# Altium schematic sheet Ｄｒｉｖｅｒｓ.SchDoc
size Letter; SheetNumber: 4; SheetTotal: 5
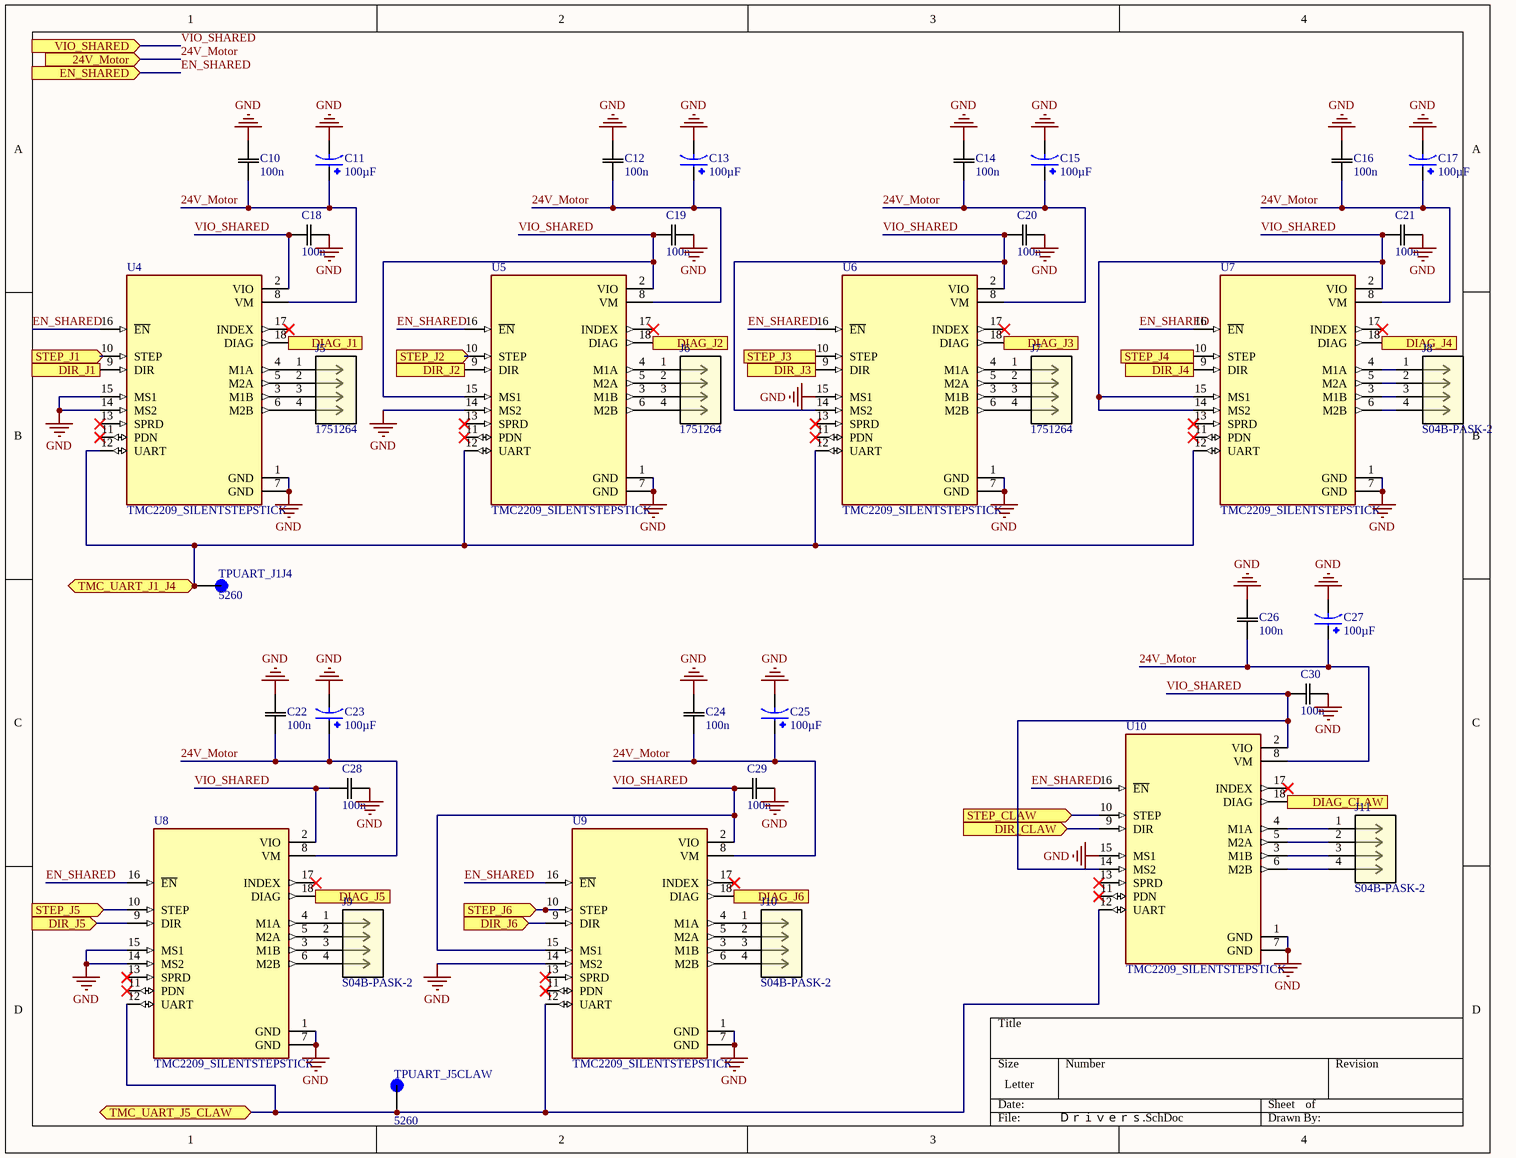
[diagram p0: Ｄｒｉｖｅｒｓ.SchDoc]

## Parts
C10  Capacitance: 100n  [CAP_CL_21_SAM]  (hidden comment: CL21B104KCCWPNC)
C11  value 100µF  [CAPPRD500W60D800H1150]  (hidden comment: EEUFR1H101B)
C12  Capacitance: 100n  [CAP_CL_21_SAM]  (hidden comment: CL21B104KCCWPNC)
C13  value 100µF  [CAPPRD500W60D800H1150]  (hidden comment: EEUFR1H101B)
C14  Capacitance: 100n  [CAP_CL_21_SAM]  (hidden comment: CL21B104KCCWPNC)
C15  value 100µF  [CAPPRD500W60D800H1150]  (hidden comment: EEUFR1H101B)
C16  Capacitance: 100n  [CAP_CL_21_SAM]  (hidden comment: CL21B104KCCWPNC)
C17  value 100µF  [CAPPRD500W60D800H1150]  (hidden comment: EEUFR1H101B)
C18  Capacitance: 100n  [CAP_CL_21_SAM]  (hidden comment: CL21B104KCCWPNC)
C19  Capacitance: 100n  [CAP_CL_21_SAM]  (hidden comment: CL21B104KCCWPNC)
C20  Capacitance: 100n  [CAP_CL_21_SAM]  (hidden comment: CL21B104KCCWPNC)
C21  Capacitance: 100n  [CAP_CL_21_SAM]  (hidden comment: CL21B104KCCWPNC)
C22  Capacitance: 100n  [CAP_CL_21_SAM]  (hidden comment: CL21B104KCCWPNC)
C23  value 100µF  [CAPPRD500W60D800H1150]  (hidden comment: EEUFR1H101B)
C24  Capacitance: 100n  [CAP_CL_21_SAM]  (hidden comment: CL21B104KCCWPNC)
C25  value 100µF  [CAPPRD500W60D800H1150]  (hidden comment: EEUFR1H101B)
C26  Capacitance: 100n  [CAP_CL_21_SAM]  (hidden comment: CL21B104KCCWPNC)
C27  value 100µF  [CAPPRD500W60D800H1150]  (hidden comment: EEUFR1H101B)
C28  Capacitance: 100n  [CAP_CL_21_SAM]  (hidden comment: CL21B104KCCWPNC)
C29  Capacitance: 100n  [CAP_CL_21_SAM]  (hidden comment: CL21B104KCCWPNC)
C30  Capacitance: 100n  [CAP_CL_21_SAM]  (hidden comment: CL21B104KCCWPNC)
J5  1751264  [CONN_1751264_PXC]
J6  1751264  [CONN_1751264_PXC]
J7  1751264  [CONN_1751264_PXC]
J8  S04B-PASK-2  [CONN4_S04B-PASK_JST]
J9  S04B-PASK-2  [CONN4_S04B-PASK_JST]
J10  S04B-PASK-2  [CONN4_S04B-PASK_JST]
J11  S04B-PASK-2  [CONN4_S04B-PASK_JST]
TPUART_J1J4  5260  [KEYSTONE_5260]
TPUART_J5CLAW  5260  [KEYSTONE_5260]
U4  TMC2209_SILENTSTEPSTICK  [MODULE_TMC2209_SILENTSTEPSTICK]
U5  TMC2209_SILENTSTEPSTICK  [MODULE_TMC2209_SILENTSTEPSTICK]
U6  TMC2209_SILENTSTEPSTICK  [MODULE_TMC2209_SILENTSTEPSTICK]
U7  TMC2209_SILENTSTEPSTICK  [MODULE_TMC2209_SILENTSTEPSTICK]
U8  TMC2209_SILENTSTEPSTICK  [MODULE_TMC2209_SILENTSTEPSTICK]
U9  TMC2209_SILENTSTEPSTICK  [MODULE_TMC2209_SILENTSTEPSTICK]
U10  TMC2209_SILENTSTEPSTICK  [MODULE_TMC2209_SILENTSTEPSTICK]

## Ports
24V_Motor (in, see Overall_Schematic[4D], Entry_Protection[4C]), DIAG_CLAW (out, see Overall_Schematic[4C], MC[3B]), DIAG_J1 (out, see Overall_Schematic[4B], MC[3A]), DIAG_J2 (out, see Overall_Schematic[4C], MC[3B]), DIAG_J3 (out, see Overall_Schematic[4C], MC[3B]), DIAG_J4 (out, see Overall_Schematic[4C], MC[3B]), DIAG_J5 (out, see Overall_Schematic[4C], MC[3B]), DIAG_J6 (out, see Overall_Schematic[4C], MC[3B]), DIR_CLAW (in, see Overall_Schematic[4B], MC[4B]), DIR_J1 (in, see Overall_Schematic[4B], MC[4B]), DIR_J2 (in, see Overall_Schematic[4B], MC[4B]), DIR_J3 (in, see Overall_Schematic[4B], MC[4B]), DIR_J4 (in, see Overall_Schematic[4B], MC[4B]), DIR_J5 (in, see Overall_Schematic[4B], MC[4B]), DIR_J6 (in, see Overall_Schematic[4B], MC[4B]), EN_SHARED (in, see Overall_Schematic[4C], MC[2B]), STEP_CLAW (in, see Overall_Schematic[4B], MC[2B]), STEP_J1 (in, see Overall_Schematic[4A], MC[2C]), STEP_J2 (in, see Overall_Schematic[4A], MC[4B]), STEP_J3 (in, see Overall_Schematic[4A], MC[4B]), STEP_J4 (in, see Overall_Schematic[4A], MC[4C]), STEP_J5 (in, see Overall_Schematic[4A], MC[2C]), STEP_J6 (in, see Overall_Schematic[4A], MC[2C]), TMC_UART_J1_J4 (bidir, see Overall_Schematic[4A], MC[4C]), TMC_UART_J5_CLAW (bidir, see Overall_Schematic[4A], MC[4C]), VIO_SHARED (in, see Overall_Schematic[4C], MC[3C], Spare_Pins[1A])

## Nets
GND: C10.2 C11.N C12.2 C13.N C14.2 C15.N C16.2 C17.N C18.2 C19.2 C20.2 C21.2 C22.2 C23.N C24.2 C25.N C26.2 C27.N C28.2 C29.2 C30.2 U4.1(GND) U4.7(GND) U4.14(MS2) U4.15(MS1) U5.1(GND) U5.7(GND) U5.14(MS2) U6.1(GND) U6.7(GND) U6.15(MS1) U7.1(GND) U7.7(GND) U8.1(GND) U8.7(GND) U8.14(MS2) U8.15(MS1) U9.1(GND) U9.7(GND) U9.14(MS2) U10.1(GND) U10.7(GND) U10.15(MS1)
24V_Motor: C10.1 C11.P C12.1 C13.P C14.1 C15.P C16.1 C17.P C22.1 C23.P C24.1 C25.P C26.1 C27.P U4.8(VM) U5.8(VM) U6.8(VM) U7.8(VM) U8.8(VM) U9.8(VM) U10.8(VM) ; port 24V_Motor
DIAG_CLAW: U10.18(DIAG) ; port DIAG_CLAW
DIAG_J1: U4.18(DIAG) ; port DIAG_J1
DIAG_J2: U5.18(DIAG) ; port DIAG_J2
DIAG_J3: U6.18(DIAG) ; port DIAG_J3
DIAG_J4: U7.18(DIAG) ; port DIAG_J4
DIAG_J5: U8.18(DIAG) ; port DIAG_J5
DIAG_J6: U9.18(DIAG) ; port DIAG_J6
DIR_CLAW: U10.9(DIR) ; port DIR_CLAW
DIR_J1: U4.9(DIR) ; port DIR_J1
DIR_J2: U5.9(DIR) ; port DIR_J2
DIR_J3: U6.9(DIR) ; port DIR_J3
DIR_J4: U7.9(DIR) ; port DIR_J4
DIR_J5: U8.9(DIR) ; port DIR_J5
DIR_J6: U9.9(DIR) ; port DIR_J6
EN_SHARED: U4.16(~{EN}) U5.16(~{EN}) U6.16(~{EN}) U7.16(~{EN}) U8.16(~{EN}) U9.16(~{EN}) U10.16(~{EN}) ; port EN_SHARED
STEP_CLAW: U10.10(STEP) ; port STEP_CLAW
STEP_J1: U4.10(STEP) ; port STEP_J1
STEP_J2: U5.10(STEP) ; port STEP_J2
STEP_J3: U6.10(STEP) ; port STEP_J3
STEP_J4: U7.10(STEP) ; port STEP_J4
STEP_J5: U8.10(STEP) ; port STEP_J5
STEP_J6: U9.10(STEP) ; port STEP_J6
TMC_UART_J1_J4: TPUART_J1J4.1(TP) U4.12(UART) U5.12(UART) U6.12(UART) U7.12(UART) ; port TMC_UART_J1_J4
TMC_UART_J5_CLAW: TPUART_J5CLAW.1(TP) U8.12(UART) U9.12(UART) U10.12(UART) ; port TMC_UART_J5_CLAW
VIO_SHARED: C18.1 C19.1 C20.1 C21.1 C28.1 C29.1 C30.1 U4.2(VIO) U5.2(VIO) U5.15(MS1) U6.2(VIO) U6.14(MS2) U7.2(VIO) U7.14(MS2) U7.15(MS1) U8.2(VIO) U9.2(VIO) U9.15(MS1) U10.2(VIO) U10.14(MS2) ; port VIO_SHARED
NetJ5_1: J5.1 U4.4(M1A)
NetJ5_2: J5.2 U4.5(M2A)
NetJ5_3: J5.3 U4.3(M1B)
NetJ5_4: J5.4 U4.6(M2B)
NetJ6_1: J6.1 U5.4(M1A)
NetJ6_2: J6.2 U5.5(M2A)
NetJ6_3: J6.3 U5.3(M1B)
NetJ6_4: J6.4 U5.6(M2B)
NetJ7_1: J7.1 U6.4(M1A)
NetJ7_2: J7.2 U6.5(M2A)
NetJ7_3: J7.3 U6.3(M1B)
NetJ7_4: J7.4 U6.6(M2B)
NetJ8_1: J8.1 U7.4(M1A)
NetJ8_2: J8.2 U7.5(M2A)
NetJ8_3: J8.3 U7.3(M1B)
NetJ8_4: J8.4 U7.6(M2B)
NetJ9_1: J9.1 U8.4(M1A)
NetJ9_2: J9.2 U8.5(M2A)
NetJ9_3: J9.3 U8.3(M1B)
NetJ9_4: J9.4 U8.6(M2B)
NetJ10_1: J10.1 U9.4(M1A)
NetJ10_2: J10.2 U9.5(M2A)
NetJ10_3: J10.3 U9.3(M1B)
NetJ10_4: J10.4 U9.6(M2B)
NetJ11_1: J11.1 U10.4(M1A)
NetJ11_2: J11.2 U10.5(M2A)
NetJ11_3: J11.3 U10.3(M1B)
NetJ11_4: J11.4 U10.6(M2B)

Not connected (* = marked no-connect by the designer): U4 11(PDN)* 13(SPRD)* 17(INDEX)*; U5 11(PDN)* 13(SPRD)* 17(INDEX)*; U6 11(PDN)* 13(SPRD)* 17(INDEX)*; U7 11(PDN)* 13(SPRD)* 17(INDEX)*; U8 11(PDN)* 13(SPRD)* 17(INDEX)*; U9 11(PDN)* 13(SPRD)* 17(INDEX)*; U10 11(PDN)* 13(SPRD)* 17(INDEX)*

## Library data of the parts
C10 C12 C14 C16 C18-C22 C24 C26 C28-C30 = CL21B104KCCWPNC: No Description Available; Manufacturer_Name: Samsung; Copyright: Copyright (C) 2026 Ultra Librarian. All rights reserved.; Manufacturer_Part_Number: CL21B104KCCWPNC
C11 C13 C15 C17 C23 C25 C27 = CMP-001-00084-1: Cap Aluminum 100uF 50V 20% (8 X 11.5mm) Radial 5mm 870mA 6000 hr 105C Ammo Pack; MP: EEU-FR1H101B; MF: Panasonic Electronic; Pins: 2; Design Item ID: EEUFR1H101B; Purchase-URL: https://pricing.snapeda.com/search/part/EEU-FR1H101B/?ref=eda; Case/Package: RADIAL-2 Panasonic; Check_prices: https://www.snapeda.com/parts/EEU-FR1H101B/Panasonic%20Electronic%20Components/view-part/1356823/?ref=eda; SnapEDA_Link: https://www.snapeda.com/parts/EEU-FR1H101B/Panasonic%20Electronic%20Components/view-part/1356823/?ref=snap; Source: EEUFR1H101B.SchLib; Availability: In Stock; Price: None; Component Type: Standard
J5-J7 = 1751264: PCB terminal block, nominal current: 17.5 A, rated voltage (III/2): 200 V, nominal cross section: 1.5 mmÂ², number of potentials: 4, number of rows: 1, number of positions per row: 4, product range: MKDS 1, pitch: 3.5 mm, connection method: Screw connection with tension sleeve, screw head form: L Slotted, mounting: Wave soldering, conductor/PCB connection direction: 0 Â°, color: green, Pin layout: Linear pinning, Solder pin [P]: 3.5 mm, number of solder pins per potential: 1, type of packaging: packed in cardboard. Suitable for CAT5; Manufacturer_Name: Phoenix Contact; Copyright: Copyright (C) 2025 Ultra Librarian. All rights reserved.; Manufacturer_Part_Number: 1751264; RefDes: RefDes; Type: Type
J8-J11 = S04B-PASK-2: Description; Manufacturer_Name: JST; Type: Headers, Male Pins; Copyright: Copyright (C) 2025 Ultra Librarian. All rights reserved.; Manufacturer_Part_Number: S04B-PASK-2; RefDes: RefDes
TPUART_J1J4 TPUART_J5CLAW = CMP-007-000000-1: TEST POINT (RED) - MINIATURE; MF: Keystone Electronics; MP: 5260; Source: 5260.SchLib; Check_prices: https://www.snapeda.com/parts/5260/Keystone/view-part/?ref=eda; SnapEDA_Link: https://www.snapeda.com/parts/5260/Keystone/view-part/?ref=snap; Package: None; Pin Count: 1; Value: *; Design Item ID: 5260; Component Type: Standard
U4-U10 = CMP-005-000000-1: TMC2209 Motor Controller/Driver Power Management Evaluation Board; MP: TMC2209 SILENTSTEPSTICK; MF: Trinamic Motion Control GmbH; Pin Count: 18; SnapEDA_Link: https://www.snapeda.com/parts/TMC2209%20SILENTSTEPSTICK/Trinamic/view-part/?ref=snap; Source: TMC2209_SILENTSTEPSTICK.SchLib; Design Item ID: TMC2209_SILENTSTEPSTICK; Component Type: Standard; Package: None; Check_prices: https://www.snapeda.com/parts/TMC2209%20SILENTSTEPSTICK/Trinamic/view-part/?ref=eda; Value: *